# Altium schematic sheet Power Supply.SchDoc
size A4; SheetNumber: 8; SheetTotal: 8
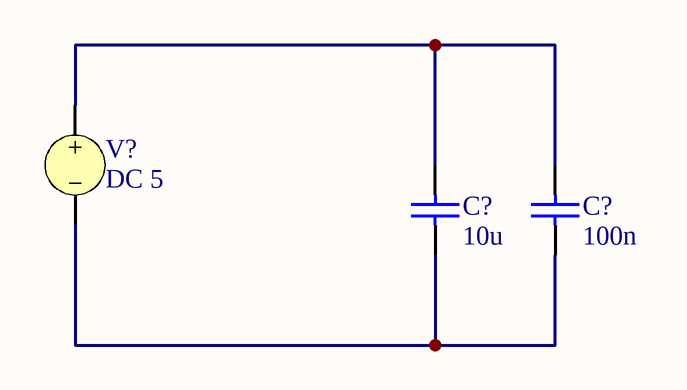
[diagram p0: Power Supply.SchDoc]

## Parts
(Parts that share a designator on the sheet are numbered #1, #2 ... from top to bottom, then left to right.)
C?#1  value 10u  (hidden comment: Capacitor)
C?#2  value 100n  (hidden comment: Capacitor)
V?  DC 5

## Nets
NetC?#1_1: C?#1.1 C?#2.1 V?.2
NetC?#1_2: C?#1.2 C?#2.2 V?.1

## Library data of the parts
C?#1 C?#2 = Capacitor: SimulationGenericComponent: True
V? = VSRC: Voltage Source; Note: PCB Footprint - Not required; AC Magnitude: 1; AC Phase: 0; Value: 5; Published: 8-Jun-2000; LatestRevisionDate: 17-Jul-2002; LatestRevisionNote: Re-released for DXP Platform.; PackageReference: Not Applicable; Publisher: Altium Limited